# Altium schematic sheet battery_charger.SchDoc: Battery & Power Management
size A4; Author: Gerald Ebmer; DrawnBy: Gerald Ebmer; Engineer: Gerald Ebmer; SheetNumber: 5; SheetTotal: 6; PageSetup: Record=PageOptions|CenterHorizontal=True|CenterVertical=True|PrintScale=1.00|XCorrection=1.00|YCorrection=1.00|PrintKind=0|BorderSize=5000000|LeftOffset=0|BottomOffset=0|Orientation=2|PaperLength=1000|PaperWidth=1000|Scale=100|PaperSource=7|PrintQuality=-3|MediaType=1|DitherType=10|PrintScaleMode=1|PaperKind=A4|PaperIndex=9
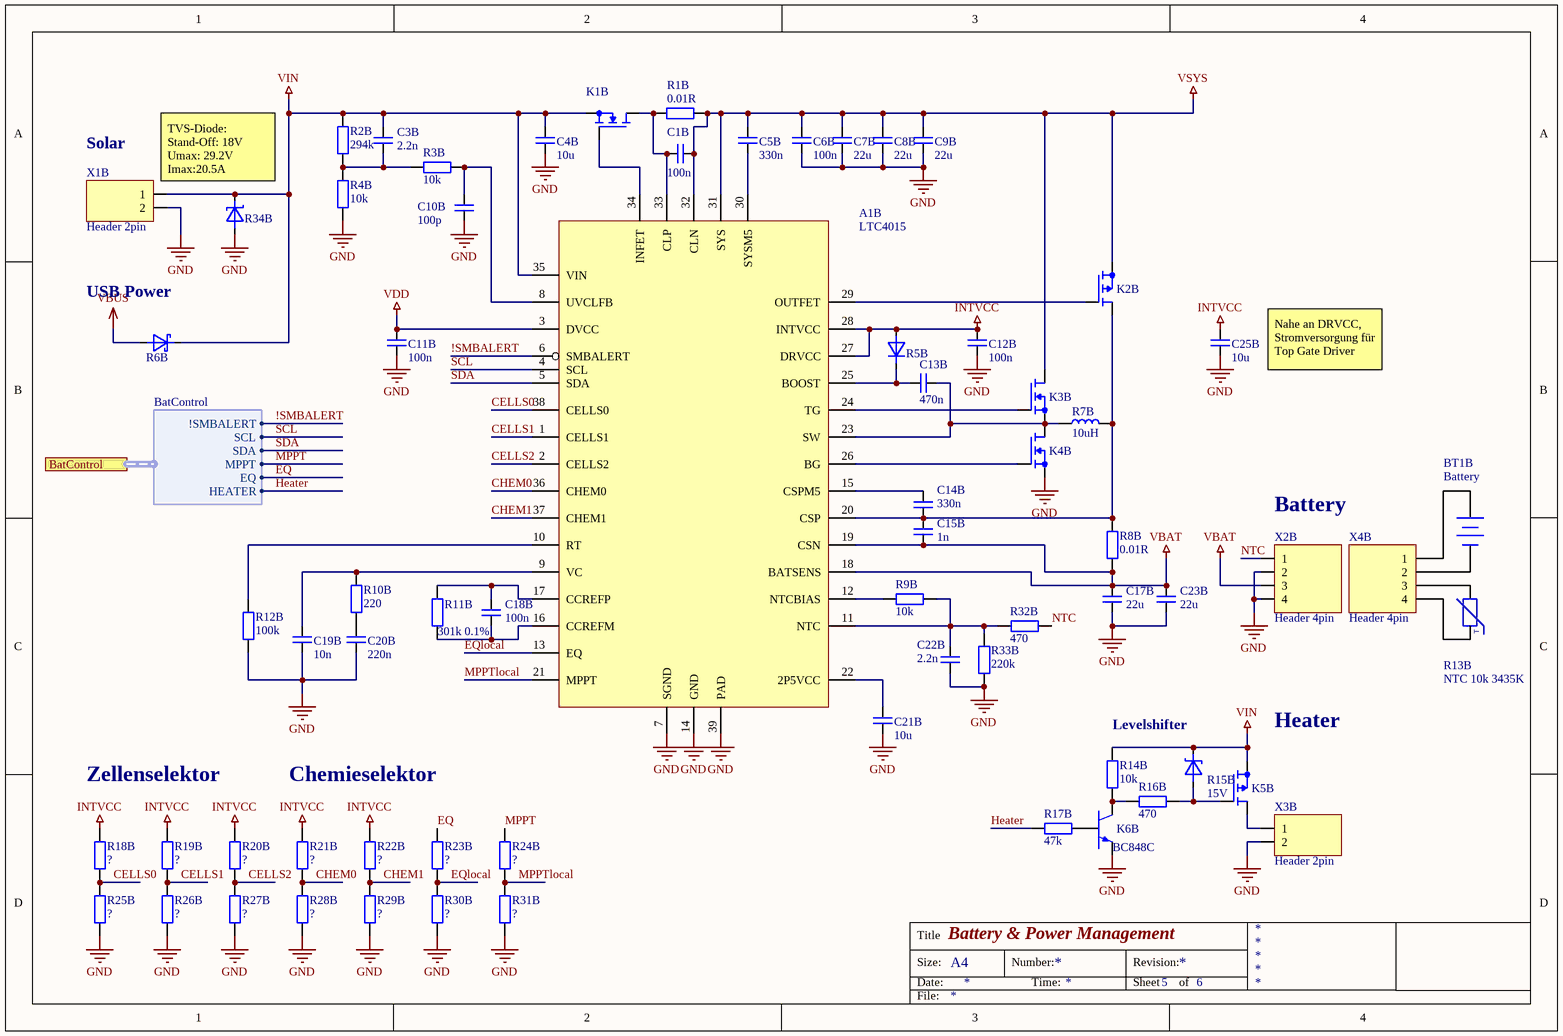
[diagram p0: battery_charger.SchDoc]

## Parts
A1B  LTC4015  [QFN38]
BT1B  Battery
C1B  100n  [0805]
C3B  2.2n  [0805]
C4B  10u  [1812]
C5B  330n  [0805]
C6B  100n  [0805]
C7B  22u  [1812]
C8B  22u  [1812]
C9B  22u  [1812]
C10B  100p  [0805]
C11B  100n  [0805]
C12B  100n  [0805]
C13B  470n  [0805]
C14B  330n  [0805]
C15B  1n  [0805]
C17B  22u  [1210]
C18B  100n  [0805]
C19B  10n  [0805]
C20B  220n  [0805]
C21B  10u  [0805]
C22B  2.2n  [0805]
C23B  22u  [1210]
C25B  10u  [0805]
K1B  FDMC8327L  [Power33]  (value not drawn)
K2B  SI7611DN  [Power33]  (value not drawn)
K3B  FDMC8327L  [Power33]  (value not drawn)
K4B  FDMC8327L  [Power33]  (value not drawn)
K5B  pmos FDC658  [SuperSOT-6]  (value not drawn)
K6B  BC848C  [SOT23-3]
R1B  0.01R  [2512]
R2B  294k  [0805]
R3B  10k  [0805]
R4B  10k  [0805]
R5B  1N4148W  [SOD123F]  (value not drawn)
R6B  Diode shottky  [PowerDI123]  (value not drawn)
R7B  10uH  [INDP_13.2_12.9X3.5M]
R8B  0.01R  [2512]
R9B  10k  [0805]
R10B  220  [0805]
R11B  301k 0.1%  [0805]
R12B  100k  [0805]
R13B  NTC 10k 3435K
R14B  10k  [0805]
R15B  15V  [SOD523]
R16B  470  [0805]
R17B  47k  [0805]
R18B  ?  [0805]
R19B  ?  [0805]
R20B  ?  [0805]
R21B  ?  [0805]
R22B  ?  [0805]
R23B  ?  [0805]
R24B  ?  [0805]
R25B  ?  [0805]
R26B  ?  [0805]
R27B  ?  [0805]
R28B  ?  [0805]
R29B  ?  [0805]
R30B  ?  [0805]
R31B  ?  [0805]
R32B  470  [0805]
R33B  220k  [0805]
R34B  TVS 29.2Vmax  [DO 214AA]  (value not drawn)
X1B  Header 2pin  [PHOENIX_1729128]
X2B  Header 4pin  [Phoenix, 5mm pitch, 4pin]
X3B  Header 2pin  [PHOENIX_1729128]
X4B  Header 4pin

## Ports
BatControl (harness BatControl)

## Harnesses
BatControl: !SMBALERT, SCL, SDA, MPPT, EQ, HEATER

## Nets
GND: A1B.7(SGND) A1B.14(GND) A1B.39(PAD) C4B.2 C6B.2 C7B.2 C8B.2 C9B.2 C10B.1 C11B.2 C12B.2 C17B.2 C19B.2 C20B.1 C21B.2 C22B.1 C23B.2 C25B.2 K4B.2(Source) K6B.2(Emitter) R4B.1 R12B.2 R25B.2 R26B.2 R27B.2 R28B.2 R29B.2 R30B.2 R31B.2 R33B.2 R34B.2(Annode) X1B.2 X2B.2 X2B.4 X3B.2
INTVCC: A1B.27(DRVCC) A1B.28(INTVCC) C12B.1 C25B.1 R5B.2(Annode) R18B.1 R19B.1 R20B.1 R21B.1 R22B.1
VBAT: A1B.18(BATSENS) A1B.19(CSN) C15B.1 C17B.1 C23B.1 R8B.2 X2B.3
VBUS: R6B.2(Annode)
VDD: A1B.3(DVCC) C11B.1
VIN: A1B.35(VIN) C3B.2 C4B.1 K1B.2(Source) K5B.2(Source) R2B.2 R6B.1(Kathode) R14B.2 R15B.1(Kathode) R34B.1(Kathode) X1B.1
VSYS: A1B.31(SYS) A1B.32(CLN) C1B.1 C5B.1 C6B.1 C7B.1 C8B.1 C9B.1 K2B.2(Source) K3B.1(Drain) R1B.1
!SMBALERT: A1B.6(SMBALERT) ; port BatControl.!SMBALERT
CELLS0: A1B.38(CELLS0) R18B.2 R25B.1
CELLS1: A1B.1(CELLS1) R19B.2 R26B.1
CELLS2: A1B.2(CELLS2) R20B.2 R27B.1
CHEM0: A1B.36(CHEM0) R21B.2 R28B.1
CHEM1: A1B.37(CHEM1) R22B.2 R29B.1
EQ: R23B.1 ; port BatControl.EQ
EQlocal: A1B.13(EQ) R23B.2 R30B.1
Heater: R17B.1 ; port BatControl.HEATER
MPPT: R24B.1 ; port BatControl.MPPT
MPPTlocal: A1B.21(MPPT) R24B.2 R31B.1
NTC: R32B.2 X2B.1
SCL: A1B.4(SCL) ; port BatControl.SCL
SDA: A1B.5(SDA) ; port BatControl.SDA
NetA1B_8: A1B.8(UVCLFB) C10B.2 R3B.1
NetA1B_9: A1B.9(VC) C19B.1 R10B.1
NetA1B_10: A1B.10(RT) R12B.1
NetA1B_11: A1B.11(NTC) C22B.2 R9B.1 R32B.1 R33B.1
NetA1B_12: A1B.12(NTCBIAS) R9B.2
NetA1B_15: A1B.15(CSPM5) C14B.1
NetA1B_16: A1B.16(CCREFM) C18B.1 R11B.2
NetA1B_17: A1B.17(CCREFP) C18B.2 R11B.1
NetA1B_20: A1B.20(CSP) C14B.2 C15B.2 K2B.1(Drain) R7B.2 R8B.1
NetA1B_22: A1B.22(2P5VCC) C21B.1
NetA1B_23: A1B.23(SW) C13B.1 K3B.2(Source) K4B.1(Drain) R7B.1
NetA1B_24: A1B.24(TG) K3B.3(Gate)
NetA1B_25: A1B.25(BOOST) C13B.2 R5B.1(Kathode)
NetA1B_26: A1B.26(BG) K4B.3(Gate)
NetA1B_29: A1B.29(OUTFET) K2B.3(Gate)
NetA1B_30: A1B.30(SYSM5) C5B.2
NetA1B_33: A1B.33(CLP) C1B.2 K1B.1(Drain) R1B.2
NetA1B_34: A1B.34(INFET) K1B.3(Gate)
NetC3B_1: C3B.1 R2B.1 R3B.2 R4B.2
NetC20B_2: C20B.2 R10B.2
NetK5B_1: K5B.1(Drain) X3B.1
NetK5B_3: K5B.3(Gate) R15B.2(Annode) R16B.2
NetK6B_1: K6B.1(Collector) R14B.1 R16B.1
NetK6B_3: K6B.3(Basis) R17B.2

Not connected (* = marked no-connect by the designer): BT1B 1(+) 2(-); R13B 1 2; X4B 1 2 3 4

## Notes on the sheet
- (near X1B) Solar
- TVS-Diode:
  Stand-Off: 18V
  Umax: 29.2V
  Imax:20.5A
- (near R6B) USB Power
- (near C25B) Nahe an DRVCC, Stromversorgung für Top Gate Driver
- (near X2B) Battery
- Zellenselektor
- Chemieselektor
- Levelshifter
- (near K5B) Heater
- Title
- Size:
- Date:
- A4
- Number:
- Time:
- Revision:
- Sheet
- of
- File:
- (in symbol PTC) T

## Library data of the parts
A1B = LTC4015: Multichemistry Buck Battery Charger Controller with Digital Telemetry System; Bauform: *; Bestell-Nr.: *; Bezeichnung: *; Hersteller: *; Lieferant: *; Preis: *
BT1B = Battery: Multicell Battery; Published: 24-Mar-1999; LatestRevisionDate: 17-Jul-2002; LatestRevisionNote: Re-released for DXP Platform.; PackageReference: BAT-2; Publisher: Altium Limited; PackageDescription: Battery; 2 Leads
C1B C6B C11B C12B C18B = Kondensator: Bezeichnung: 08055C104KAT2A; Hersteller: AVX; Lieferant: RS Components; Bestell-Nr.: 464-6688; Bauform: 0805
C3B C22B = Kondensator: Bezeichnung: MC0805B222K500CT; Hersteller: MULTICOMP; Lieferant: Farnell; Bestell-Nr.: 1759235; Bauform: *; Preis: *
C4B C21B C25B = Kondensator: Bezeichnung: C1210C106K3RACTU; Hersteller: Kemet; Lieferant: Farnell; Bestell-Nr.: 1358512; Bauform: *; Preis: *
C5B C14B = Kondensator: Bezeichnung: 08053C334KAT2A; Hersteller: AVX; Lieferant: Farnell; Bestell-Nr.: 1833878; Bauform: *; Preis: *
C7B C8B C9B = Kondensator: Bezeichnung: CGA8P1X7R1E226M250KC; Hersteller: TDK; Lieferant: RS Components; Bestell-Nr.: 915-5465; Bauform: *; Preis: *
C10B = Kondensator: Bezeichnung: MC0805N101J500CT; Hersteller: MULTICOMP; Lieferant: Farnell; Bestell-Nr.: 1759203; Bauform: *; Preis: *
C13B = Kondensator: Bezeichnung: MC0805B474K500CT; Hersteller: MULTICOMP; Lieferant: Farnell; Bestell-Nr.: 2320847; Bauform: *; Preis: *
C15B = Kondensator: Bezeichnung: MCU0805C102JCT; Hersteller: MULTICOMP; Lieferant: Farnell; Bestell-Nr.: 9406212; Bauform: *; Preis: *
C17B C23B = Kondensator: Bezeichnung: C3225X7R1C226K250AC; Hersteller: TDK; Lieferant: Farnell; Bestell-Nr.: 2112725; Bauform: *; Preis: *
C19B = Kondensator: Bezeichnung: C0805C103M5RACTU; Hersteller: Kemet; Lieferant: Farnell; Bestell-Nr.: 2581081; Bauform: 0805
C20B = Kondensator: Bezeichnung: C0805C224K5RACTU; Hersteller: Kemet; Lieferant: Farnell; Bestell-Nr.: 1288261; Bauform: *; Preis: *
K1B K3B K4B = MOSFET N-channel enh: Lieferant: RS Components; Hersteller: Fairchild Semiconductor; Bestell-Nr.: 864-8203; Bezeichnung: FDMC8327L; Preis: *; Bauform: *
K2B = MOSFET P-channel enh: Bezeichnung: SI7611DN-T1-GE3; Lieferant: Farnell; Hersteller: Vishay; Bestell-Nr.: 2547310; Preis: *; Bauform: *
K5B = MOSFET P-channel enh: Bezeichnung: FDC658P; Lieferant: RS Components; Hersteller: Fairchild; Bestell-Nr.: 671-0359; Bauform: SuperSOT-6
K6B = Transistor NPN: Lieferant: RS Components; Hersteller: Infineon; Bestell-Nr.: 445-2039; Bezeichnung: BC848C; Preis: *; Bauform: *
R1B R8B = Widerstand: Bezeichnung: ERJM1WSF10MU; Lieferant: RS Components; Bestell-Nr.: 567-045; Hersteller: Panasonic; Bauform: *; Preis: *
R2B = Widerstand: Bezeichnung: ERJ6ENF2943V; Lieferant: Farnell; Bestell-Nr.: 2303812; Hersteller: PANASONIC ELECTRONIC COMPONENTS; Bauform: 0805; Preis: *
R3B R4B R9B R14B = Widerstand: Bezeichnung: MCWR08X1002FTL; Lieferant: Farnell; Bestell-Nr.: 2447553; Hersteller: MULTICOMP; Bauform: 0805; Preis: *
R5B = Diode: Bezeichnung: 1N4148W-7-F.; Lieferant: Farnell; Hersteller: Diodes Inc; Bestell-Nr.: 1776392; Preis: *; Bauform: *
R6B = Diode shottky: Bezeichnung: DFLS240L-7; Lieferant: RS Components; Hersteller: DiodesZetex; Bestell-Nr.: 708-2337; Preis: *; Bauform: *
R7B = Induktivität: Bezeichnung: IHLP5050CEER100M01; Lieferant: RS Components; Bestell-Nr.: 748-7331; Hersteller: Vishay; Bauform: *; Preis: *
R10B = Widerstand: Bezeichnung: MCWR08X2200FTL; Lieferant: Farnell; Bestell-Nr.: 2447606; Hersteller: MULTICOMP; Bauform: 0805; Preis: *
R11B = Widerstand: Bezeichnung: RP73PF2A301KBTDF; Lieferant: Farnell; Bestell-Nr.: 2117426; Hersteller: TE CONNECTIVITY; Bauform: *; Preis: *
R12B = Widerstand: Bezeichnung: MCWR08X1003FTL; Lieferant: Farnell; Bestell-Nr.: 2447551; Hersteller: MULTICOMP; Bauform: 0805; Preis: *
R13B = PTC: Lieferant: Farnell; Bestell-Nr.: 2492885; Hersteller: Vishay; Bezeichnung: NTCLE413E2103F102L; Preis: *; Bauform: *
R15B = Diode zener: Bezeichnung: MM5Z15V; Lieferant: RS Components; Hersteller: Fairchild Semiconductor; Bestell-Nr.: 802-3004; Preis: *; Bauform: *
R16B R32B = Widerstand: Bezeichnung: MCWR08X4700FTL; Lieferant: Farnell; Bestell-Nr.: 2447662; Hersteller: MULTICOMP; Bauform: 0805; Preis: *
R17B = Widerstand: Bezeichnung: MCWR08X4702FTL; Lieferant: Farnell; Bestell-Nr.: 2447664; Hersteller: MULTICOMP; Bauform: 0805; Preis: *
R18B R19B R20B R21B R22B R23B R24B R25B R26B R27B R28B R29B R30B R31B = Widerstand: Bezeichnung: *; Lieferant: *; Bestell-Nr.: *; Bauform: *; Hersteller: *; Preis: *
R33B = Widerstand: Bezeichnung: MCWR08X224 JTL; Lieferant: Farnell; Bestell-Nr.: 2695016; Hersteller: MULTICOMP; Bauform: 0805; Preis: *
R34B = Diode TVS unipolar: unipolar transient voltage suppression diode; Bezeichnung: SMBJ18A-E3/52; Lieferant: RS Components; Hersteller: Vishay; Bestell-Nr.: 636-5303; Preis: *; Bauform: *
X1B X3B = Header 2pin: Hersteller: Phoenix Contact; Lieferant: RS Components; Bezeichnung: 1729128; Bestell-Nr.: 193-0586; Bauform: *; Preis: *
X2B = Header 4pin: Hersteller: PHOENIX CONTACT; Bestell-Nr.: 2671251; Lieferant: Farnell; Bezeichnung: MSTBA 2,5/ 4-G; Preis: *; Bauform: *
X4B = Header 4pin: Hersteller: Phoenix Contact; Bestell-Nr.: 2776549; Lieferant: Farnell; Bezeichnung: 1779851; Preis: *; Bauform: *